# Altium schematic sheet GoPro_Actuator_LED.SchDoc
size A
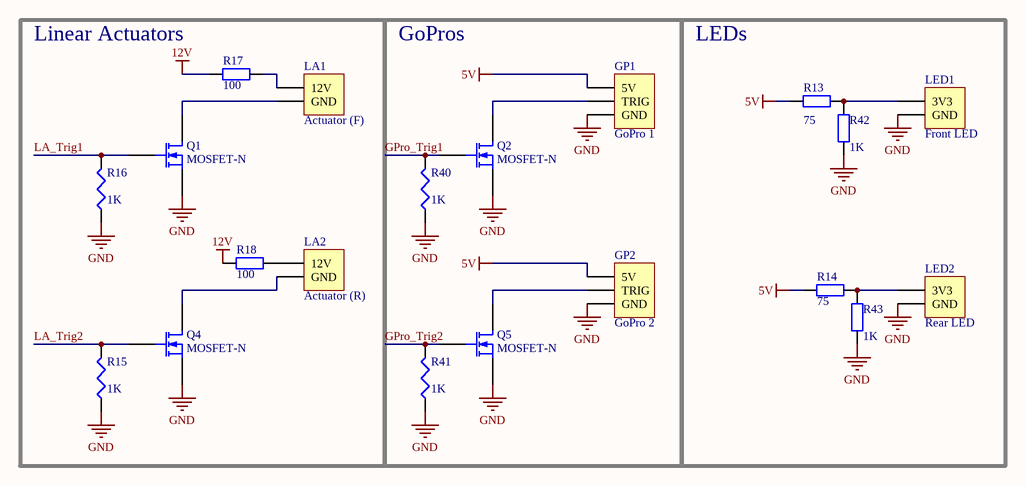
[diagram p0: GoPro_Actuator_LED.SchDoc]

## Parts
GP1  GoPro 1  [HDR1X3]
GP2  GoPro 2  [HDR1X3]
LA1  Actuator (F)  [HDR1X2]
LA2  Actuator (R)  [HDR1X2]
LED1  Front LED  [HDR1X2]
LED2  Rear LED  [HDR1X2]
Q1  MOSFET-N  [E3]
Q2  MOSFET-N  [E3]
Q4  MOSFET-N  [E3]
Q5  MOSFET-N  [E3]
R13  value 75  [AXIAL-0.4]  (hidden comment: Res2)
R14  value 75  [AXIAL-0.4]  (hidden comment: Res2)
R15  1K  [J1-0603]
R16  1K  [J1-0603]
R17  value 100  [AXIAL-0.4]  (hidden comment: Res2)
R18  value 100  [AXIAL-0.4]  (hidden comment: Res2)
R40  1K  [J1-0603]
R41  1K  [J1-0603]
R42  value 1K  [AXIAL-0.4]  (hidden comment: Res2)
R43  value 1K  [AXIAL-0.4]  (hidden comment: Res2)

## Blocks framed on the sheet
Linear Actuators: LA1 LA2 Q1 Q4 R15-R18
GoPros: GP1 GP2 Q2 Q5 R40 R41
LEDs: LED1 LED2 R13 R14 R42 R43

## Nets
5V: GP1.1(5V) GP2.1(5V) R13.2 R14.2
12V: R17.1 R18.1
GND: GP1.3(GND) GP2.3(GND) LED1.2(GND) LED2.2(GND) Q1.3(S) Q2.3(S) Q4.3(S) Q5.3(S) R15.1 R16.1 R40.1 R41.1 R42.1 R43.2
GPro_Trig1: Q2.2(G) R40.2
GPro_Trig2: Q5.2(G) R41.2
LA_Trig1: Q1.2(G) R16.2
LA_Trig2: Q4.2(G) R15.2
NetGP1_2: GP1.2(TRIG) Q2.1(D)
NetGP2_2: GP2.2(TRIG) Q5.1(D)
NetLA1_1: LA1.1(12V) R17.2
NetLA1_2: LA1.2(GND) Q1.1(D)
NetLA2_1: LA2.1(12V) R18.2
NetLA2_2: LA2.2(GND) Q4.1(D)
NetLED1_1: LED1.1(3V3) R13.1 R42.2
NetLED2_1: LED2.1(3V3) R14.1 R43.1

## Library data of the parts
GP1 GP2 = Header 3: Header, 3-Pin; LatestRevisionDate: 17-Jul-2002; LatestRevisionNote: Re-released for DXP Platform.; Publisher: Altium Limited
LA1 LA2 LED1 LED2 = Header 2: Header, 2-Pin; LatestRevisionDate: 17-Jul-2002; LatestRevisionNote: Re-released for DXP Platform.; Publisher: Altium Limited
Q1 Q2 Q4 Q5 = MOSFET-N: N-Channel MOSFET; Published: 8-Jun-2000; LatestRevisionDate: 17-Jul-2002; LatestRevisionNote: Re-released for DXP Platform.; PackageVersion: 1995/1996; PackageReference: E3; Publisher: Altium Limited; PackageDescription: TO, Flat Index; 3 In-Line, Axial Leads; Body Dia. 4.6mm; Lead Dia. 0.5 mm (max)
R13 R14 R17 R18 R42 R43 = Res2: Resistor; Published: 8-Jun-2000; LatestRevisionDate: 17-Jul-2002; LatestRevisionNote: Re-released for DXP Platform.; PackageReference: AXIAL-0.4; Publisher: Altium Limited; PackageDescription: Axial Device, Thru-Hole; 2 Leads; 0.4 in Pin Spacing
R15 R16 R40 R41 = Res3: Resistor; Published: 8-Jun-2000; LatestRevisionDate: 29-May-2009; LatestRevisionNote: IPC-7351 Footprint Added.; PackageReference: J1-0603; Publisher: Altium Limited; PackageDescription: Chip Resistor; Value: 1K